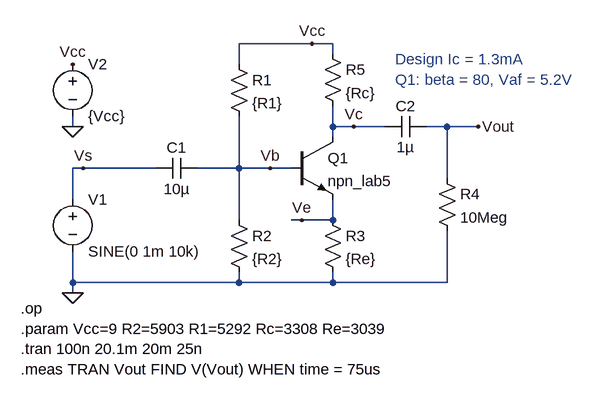
[diagram p0: schematic CE-degen-ro-gain-dc.asc]
CE-degen-ro-gain-dc.asc, the LTspice schematic file:
Version 4
SHEET 1 1296 680
WIRE 880 80 768 80
WIRE 912 80 880 80
WIRE 912 96 912 80
WIRE 768 112 768 80
WIRE 512 208 512 192
WIRE 912 208 912 176
WIRE 944 208 912 208
WIRE 992 208 944 208
WIRE 1088 208 1056 208
WIRE 1136 208 1088 208
WIRE 912 224 912 208
WIRE 528 272 512 272
WIRE 640 272 528 272
WIRE 768 272 768 192
WIRE 768 272 704 272
WIRE 816 272 768 272
WIRE 848 272 816 272
WIRE 1088 288 1088 208
WIRE 512 320 512 272
WIRE 768 352 768 272
WIRE 864 352 848 352
WIRE 912 352 912 320
WIRE 912 352 864 352
WIRE 512 448 512 400
WIRE 768 448 768 432
WIRE 768 448 512 448
WIRE 912 448 912 432
WIRE 912 448 768 448
WIRE 1088 448 1088 368
WIRE 1088 448 912 448
WIRE 512 464 512 448
FLAG 512 464 0
FLAG 1136 208 Vout
FLAG 880 80 Vcc
FLAG 816 272 Vb
FLAG 864 352 Ve
FLAG 528 272 Vs
FLAG 944 208 Vc
FLAG 512 112 Vcc
FLAG 512 208 0
SYMBOL res 896 336 R0
SYMATTR InstName R3
SYMATTR Value {Re}
SYMBOL res 896 80 R0
SYMATTR InstName R5
SYMATTR Value {Rc}
SYMBOL voltage 512 304 R0
SYMATTR InstName V1
SYMATTR Value SINE(0 1m 10k)
SYMBOL voltage 512 96 R0
SYMATTR InstName V2
SYMATTR Value {Vcc}
SYMBOL Res 752 96 R0
SYMATTR InstName R1
SYMATTR Value {R1}
SYMBOL Res 752 336 R0
SYMATTR InstName R2
SYMATTR Value {R2}
SYMBOL Cap 640 288 R270
WINDOW 0 32 32 VTop 2
WINDOW 3 0 32 VBottom 2
SYMATTR InstName C1
SYMATTR Value 10µ
SYMBOL Cap 992 224 R270
WINDOW 0 32 32 VTop 2
WINDOW 3 0 32 VBottom 2
SYMATTR InstName C2
SYMATTR Value 1µ
SYMBOL Res 1072 272 R0
SYMATTR InstName R4
SYMATTR Value 10Meg
SYMBOL npn 848 224 R0
SYMATTR InstName Q1
SYMATTR Value npn_lab5
TEXT 432 488 Left 2 !.op\n.param Vcc=9 R2=5903 R1=5292 Rc=3308 Re=3039\n.tran 100n 20.1m 20m 25n\n.meas TRAN Vout FIND V(Vout) WHEN time = 75us
TEXT 1008 104 Left 2 ;Design Ic = 1.3mA\nQ1: beta = 80, Vaf = 5.2V

The netlist it stands for:
* CE-degen-ro-gain-dc.asc
R3 Ve 0 {Re}
R5 Vcc Vc {Rc}
V1 Vs 0 SINE(0 1m 10k)
V2 Vcc 0 {Vcc}
R1 Vcc Vb {R1}
R2 Vb 0 {R2}
C1 Vs Vb 10µ
C2 Vc Vout 1µ
R4 Vout 0 10Meg
Q1 Vc Vb Ve 0 npn_lab5
.model NPN NPN
.model PNP PNP
.lib standard.bjt
.op
.param Vcc=9 R2=5903 R1=5292 Rc=3308 Re=3039
.tran 100n 20.1m 20m 25n
.meas TRAN Vout FIND V(Vout) WHEN time = 75us
* Design Ic = 1.3mA
* Q1: beta = 80, Vaf = 5.2V
.backanno
.end